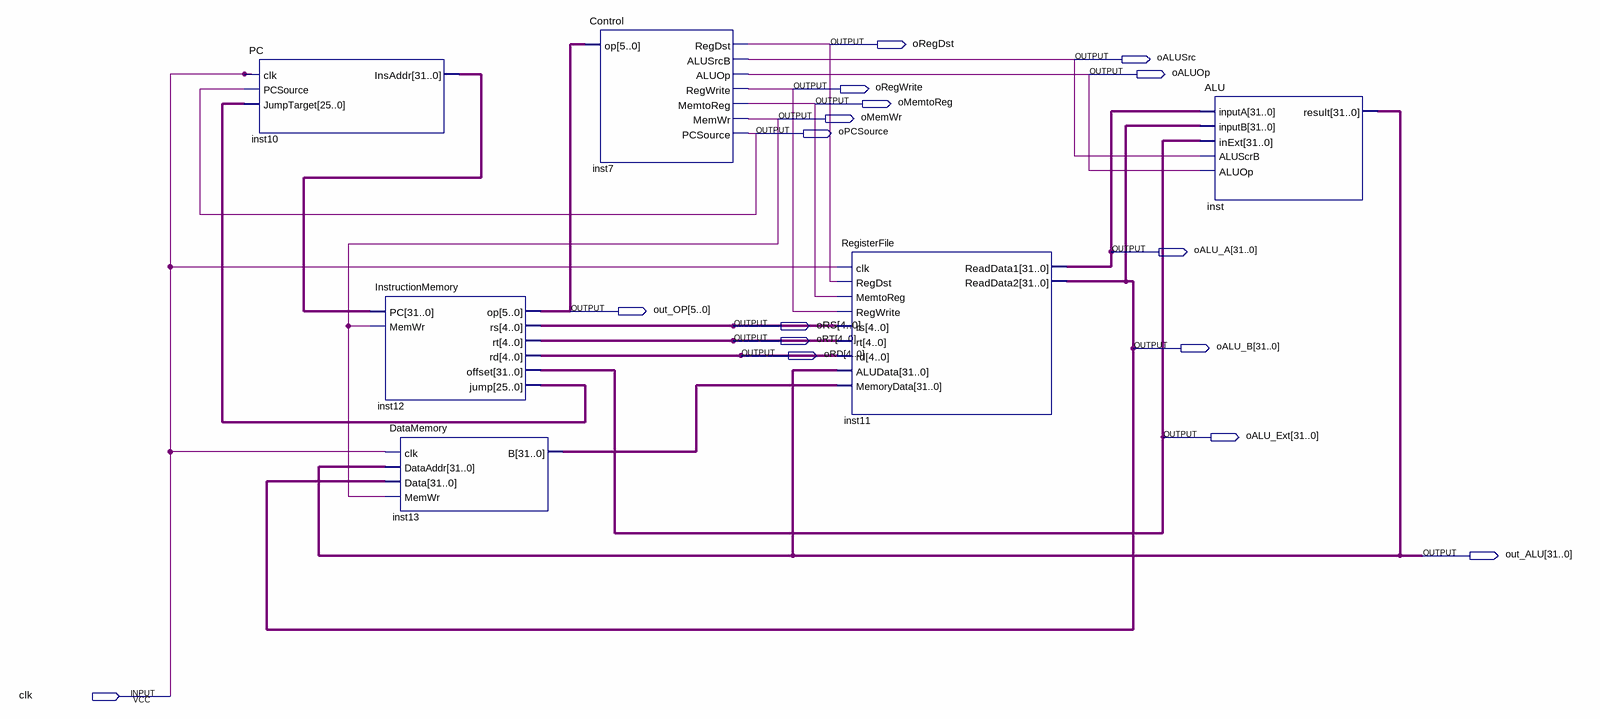
[diagram p0: schematic sheet]
// Quartus schematic SINGLE.bdf as structural Verilog: 6 symbols, 16 pins
module SINGLE (
  input  clk,
  output oRegDst,
  output oALUSrc,
  output oALUOp,
  output oRegWrite,
  output oMemtoReg,
  output oMemWr,
  output oPCSource,
  output [31:0] oALU_A,
  output [5:0] out_OP,
  output [4:0] oRS,
  output [4:0] oRT,
  output [31:0] oALU_B,
  output [4:0] oRD,
  output [31:0] oALU_Ext,
  output [31:0] out_ALU
);

  wire [25:0] inst12_jump;
  wire [31:0] inst10_insaddr, inst13_b;

  PC inst10 (.clk(clk), .PCSource(oPCSource), .JumpTarget(inst12_jump), .InsAddr(inst10_insaddr));
  InstructionMemory inst12 (
    .PC(inst10_insaddr), .MemWr(oMemWr), .op(out_OP), .rs(oRS), .rt(oRT), .rd(oRD), .offset(oALU_Ext),
    .jump(inst12_jump));
  DataMemory inst13 (.clk(clk), .DataAddr(out_ALU), .Data(oALU_B), .MemWr(oMemWr), .B(inst13_b));
  Control inst7 (
    .op(out_OP), .RegDst(oRegDst), .ALUSrcB(oALUSrc), .ALUOp(oALUOp), .RegWrite(oRegWrite),
    .MemtoReg(oMemtoReg), .MemWr(oMemWr), .PCSource(oPCSource));
  RegisterFile inst11 (
    .clk(clk), .RegDst(oRegDst), .MemtoReg(oMemtoReg), .RegWrite(oRegWrite), .rs(oRS), .rt(oRT), .rd(oRD),
    .ALUData(out_ALU), .MemoryData(inst13_b), .ReadData1(oALU_A), .ReadData2(oALU_B));
  ALU inst (.inputA(oALU_A), .inputB(oALU_B), .inExt(oALU_Ext), .ALUScrB(oALUSrc), .ALUOp(oALUOp), .result(out_ALU));
endmodule
